# EAGLE design cominer_amp (EAGLE 7.6.0)

## Sheet 1 of 2
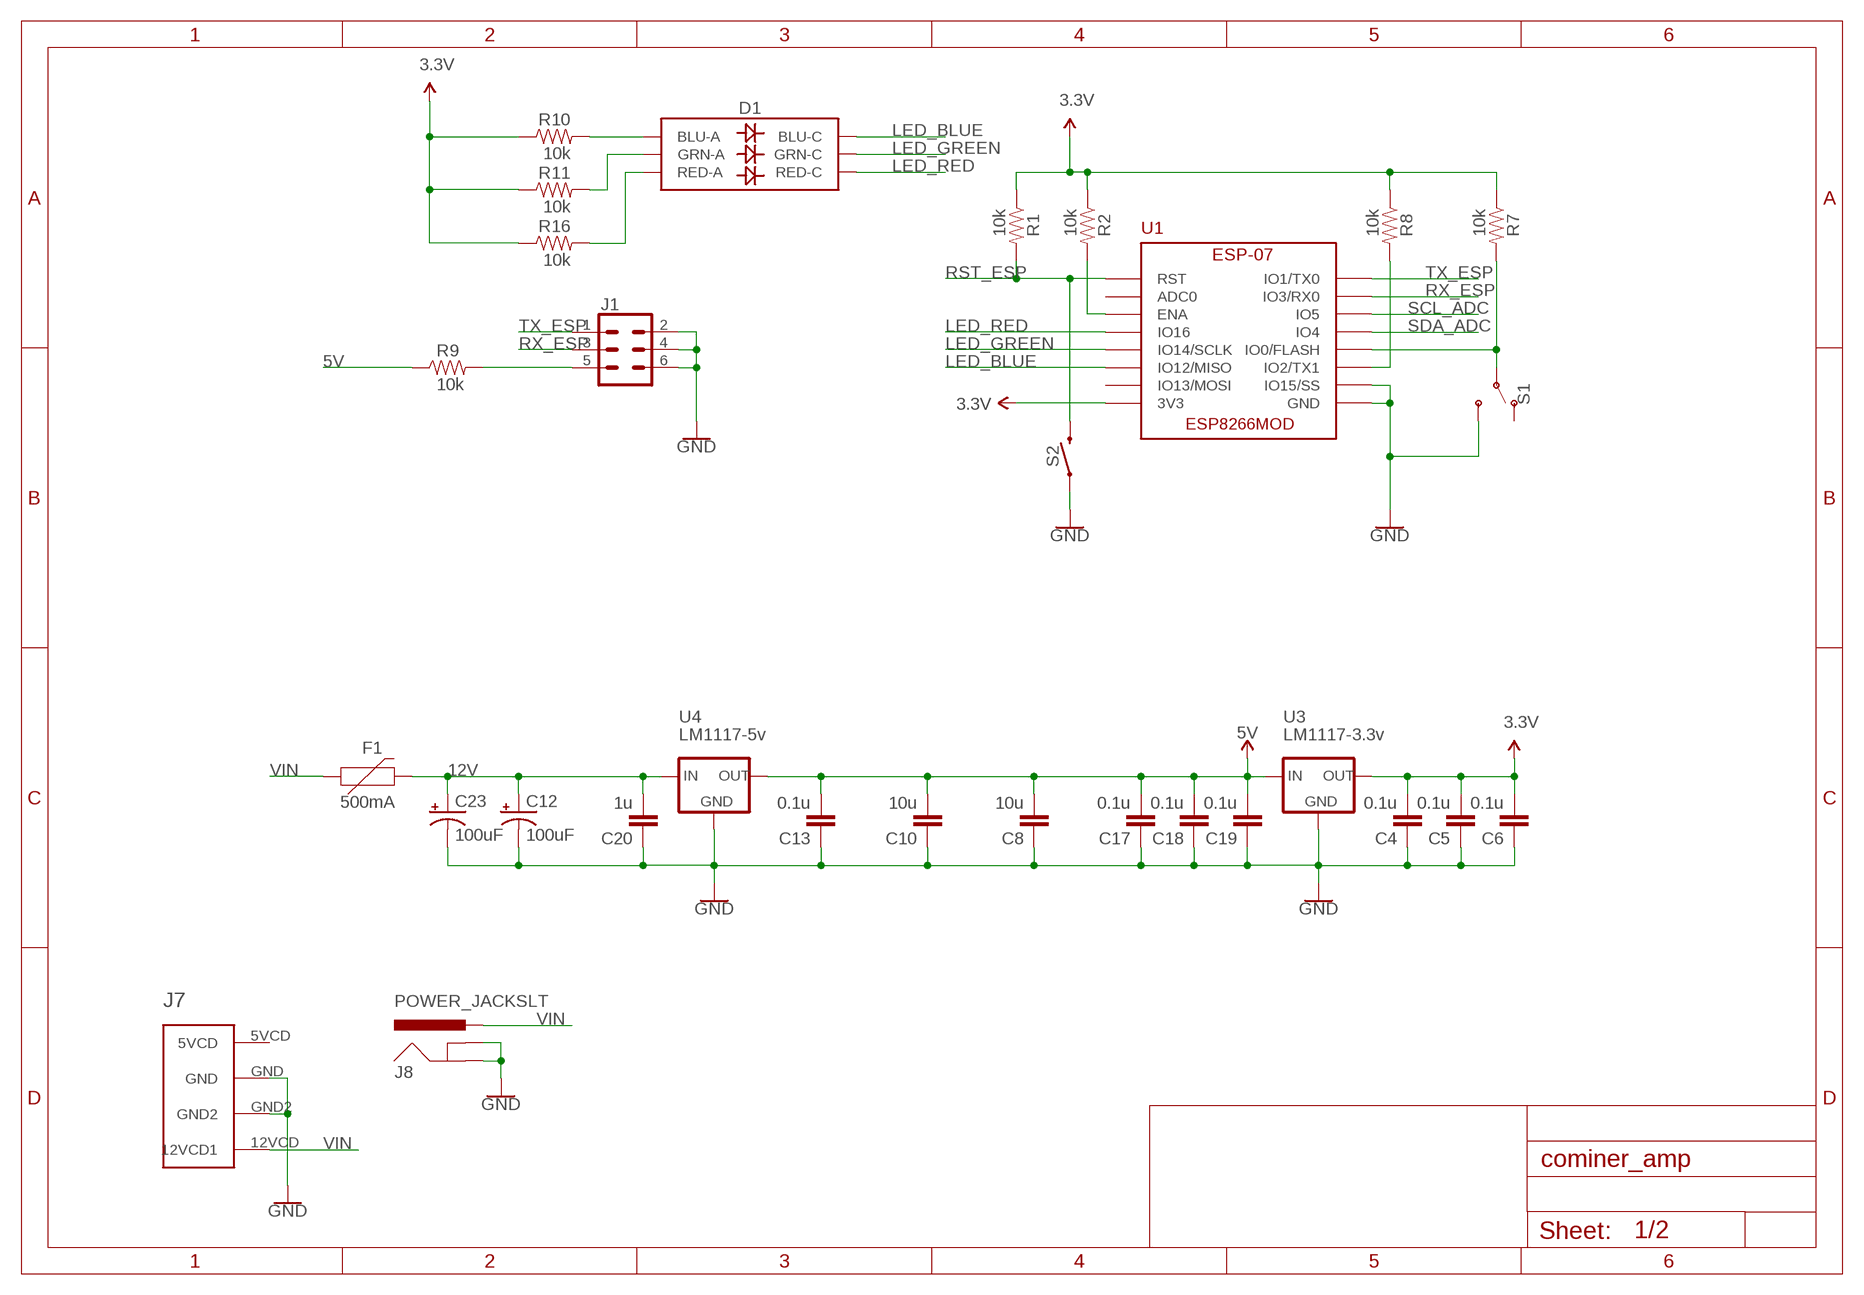
[diagram p0: schematic, sheet 1]

### Parts
C4  0.1u  CAP-0805  [0805]
C5  0.1u  CAP-0805  [0805]
C6  0.1u  CAP-0805  [0805]
C8  10u  CAP-0805  [0805]
C10  10u  CAP-0805  [0805]
C12  100uF  100UF-POLAR-25V-20%(ELEC)  [PANASONIC_D]
C13  0.1u  CAP-0805  [0805]
C17  0.1u  CAP-0805  [0805]
C18  0.1u  CAP-0805  [0805]
C19  0.1u  CAP-0805  [0805]
C20  1u  CAP-0805  [0805]
C23  100uF  100UF-POLAR-25V-20%(ELEC)  [PANASONIC_D]
D1  LED-RGBNO_IC  [LED-TRICOLOR-5050]
F1  500mA  PPTC_16V_2.5A  [1812]
J1  CONN_03X2SHROUD  [2X3-SHROUDED]
J7  MOLEX-CPU-POWER  [MOLEX-5.08-4PIN]
J8  POWER_JACKSLT  [POWER_JACK_SLOT]
R1  10k  RESISTOR0805  [0805]
R2  10k  RESISTOR0805  [0805]
R7  10k  RESISTOR0805  [0805]
R8  10k  RESISTOR0805  [0805]
R9  10k  RESISTOR0805  [0805]
R10  10k  RESISTOR0805  [0805]
R11  10k  RESISTOR0805  [0805]
R16  10k  RESISTOR0805  [0805]
S1  SWITCH-SPDT-SMD-RIGHT-ANGLE  [SWITCH_SPST_SMD_A]
S2  MOMENTARY-SWITCH-SPST-SMD-6.0X3.5MM  [TACTILE_SWITCH_SMD_6.0X3.5MM]
U1  ESP-07  [ESP-07]
U3  LM1117-3.3v  V_REG_LD1117VXXLD1117-SMD  [SOT223]
U4  LM1117-5v  V_REG_LD1117VXXLD1117-SMD  [SOT223]

### Nets
3.3V: C4.2 C5.2 C6.2 R1.1 R2.1 R7.1 R8.1 R10.1 R11.1 R16.1 U1.3V3 U3.2(OUT) ; also sheet 2
5V: C8.2 C10.2 C13.2 C17.2 C18.2 C19.2 R9.1 U3.3(IN) U4.2(OUT) ; also sheet 2
12V: C12.+ C20.2 C23.+ F1.2 U4.3(IN)
GND: C4.1 C5.1 C6.1 C8.1 C10.1 C12.- C13.1 C17.1 C18.1 C19.1 C20.1 C23.- J1.2 J1.4 J1.6 J7.GND J7.GND2 J8.GND@1(GNDBREAK) J8.GND@2(GND) S1.3(S) S2.1 U1.GND U1.IO15(IO15/SS) U3.1(GND) U4.1(GND) ; also sheet 2
LED_BLUE: D1.4(BLU-C) U1.IO12(IO12/MISO)
LED_GREEN: D1.6(GRN-C) U1.IO14(IO14/SCLK)
LED_RED: D1.5(RED-C) U1.I016(IO16)
N$2: R7.2 S1.2(P) U1.IO0(IO0/FLASH)
N$3: R8.2 U1.IO2(IO2/TX1)
N$4: J1.5 R9.2
N$8: D1.3(BLU-A) R10.2
N$9: D1.1(GRN-A) R11.2
N$10: D1.2(RED-A) R16.2
N$14: R2.2 U1.ENA
RST_ESP: R1.2 S2.2 U1.RST
RX_ESP: J1.3 U1.RX0(IO3/RX0)
SCL_ADC: U1.IO5 ; also sheet 2
SDA_ADC: U1.IO4 ; also sheet 2
TX_ESP: J1.1 U1.TX0(IO1/TX0)
VIN: F1.1 J7.12VCD(12VCD1) J8.PWR
Unconnected: J7.5VCD S1.1(O) U1.ADC(ADC0) U1.IO13(IO13/MOSI)

## Sheet 2 of 2
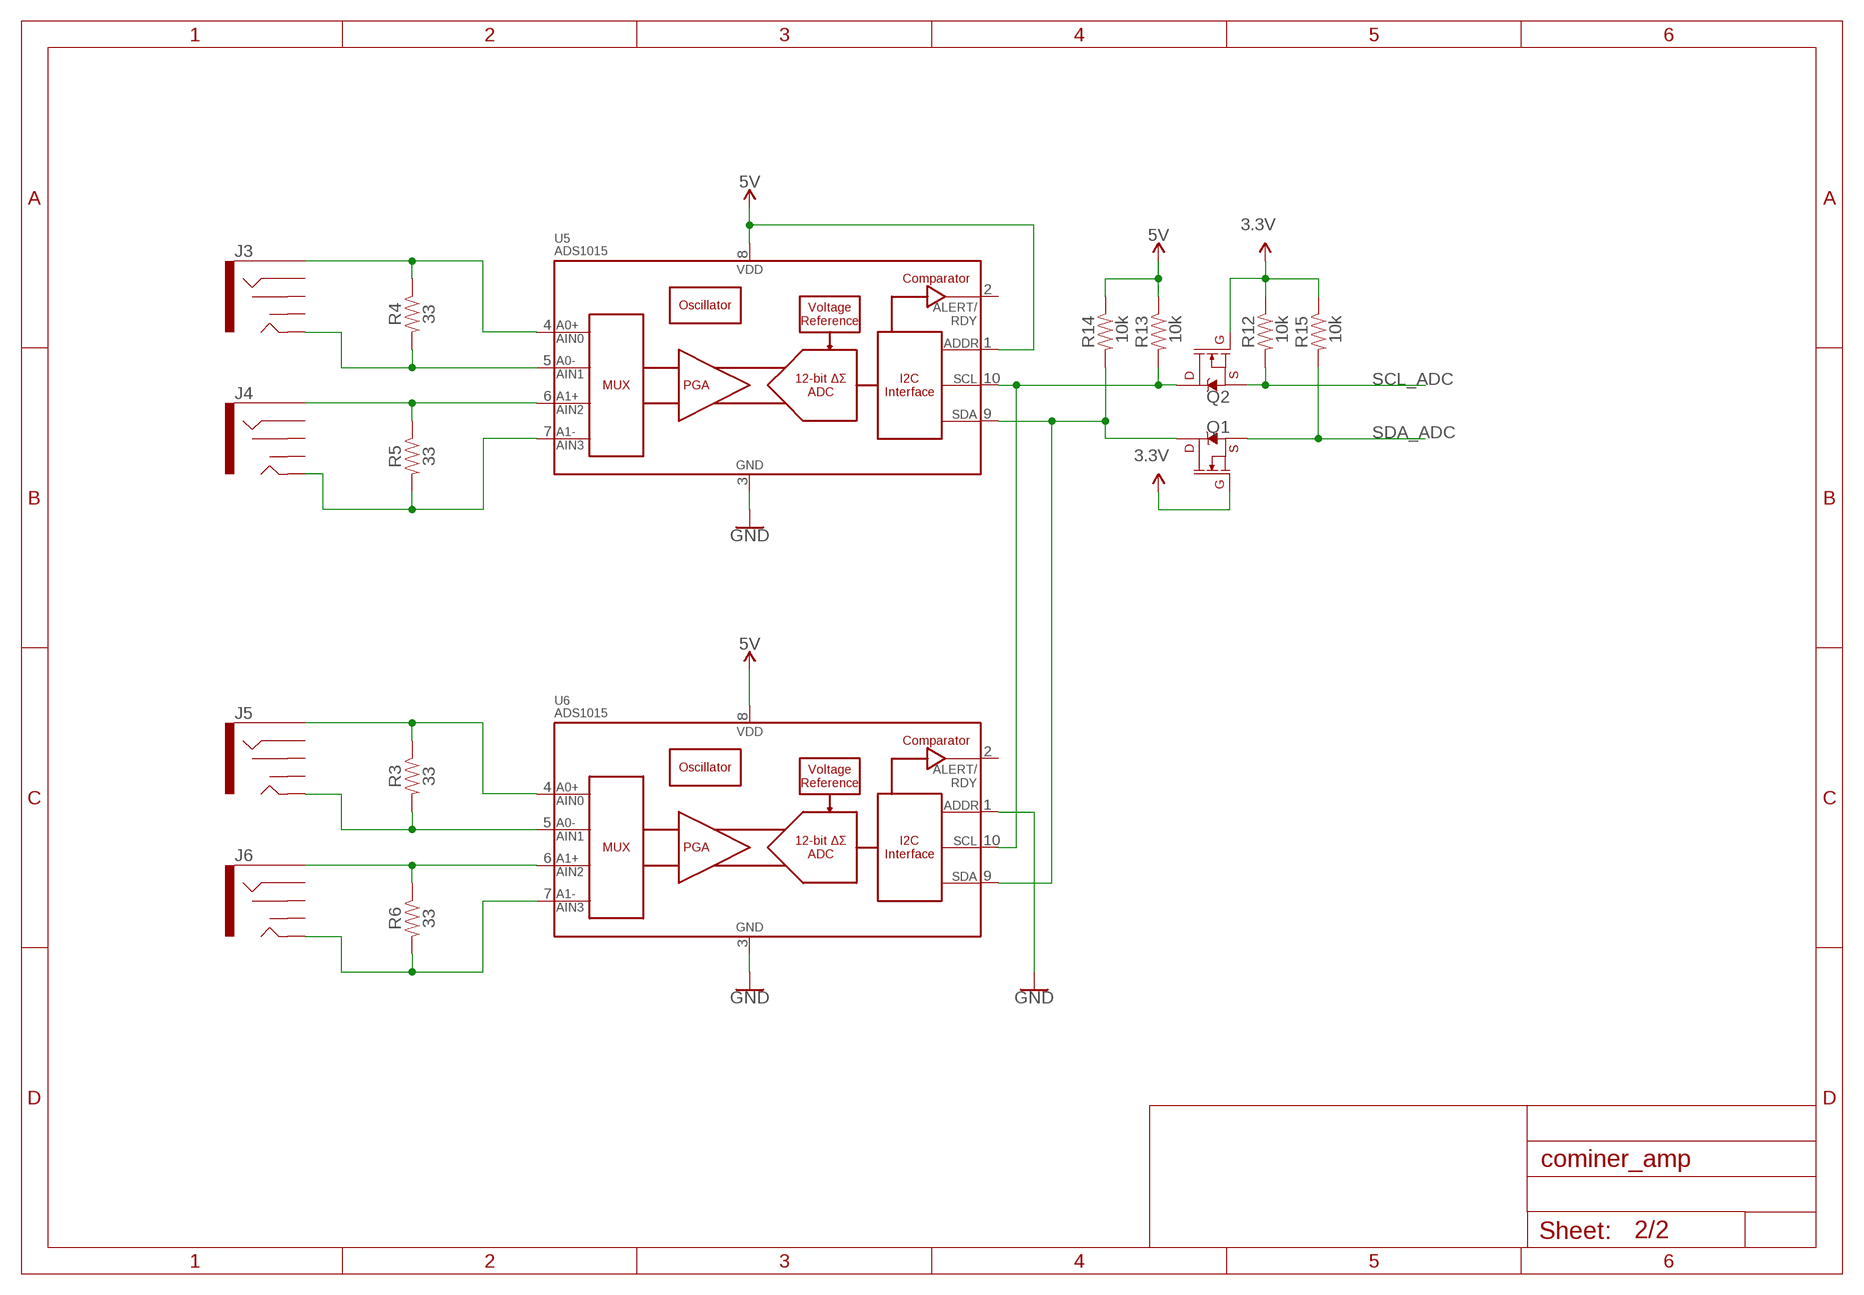
[diagram p1: schematic, sheet 2]

### Parts
J3  AUDIO_JACK_3.5MM_PTH  [AUDIO-JACK]
J4  AUDIO_JACK_3.5MM_PTH  [AUDIO-JACK]
J5  AUDIO_JACK_3.5MM_PTH  [AUDIO-JACK]
J6  AUDIO_JACK_3.5MM_PTH  [AUDIO-JACK]
Q1  BSS138  MOSFET-NCH-BSS138  [SOT23-3]
Q2  BSS138  MOSFET-NCH-BSS138  [SOT23-3]
R3  33  RESISTOR0805  [0805]
R4  33  RESISTOR0805  [0805]
R5  33  RESISTOR0805  [0805]
R6  33  RESISTOR0805  [0805]
R12  10k  RESISTOR0805  [0805]
R13  10k  RESISTOR0805  [0805]
R14  10k  RESISTOR0805  [0805]
R15  10k  RESISTOR0805  [0805]
U5  ADS1015  [MSOP10]
U6  ADS1015  [MSOP10]

### Nets
3.3V: Q1.1(G) Q2.1(G) R12.1 R15.1 ; also sheet 1
5V: R13.1 R14.1 U5.1(ADDR) U5.8(VDD) U6.8(VDD) ; also sheet 1
GND: U5.3(VSS) U6.1(ADDR) U6.3(VSS) ; also sheet 1
N$1: J4.TIP R5.2 U5.7(AIN3)
N$16: J3.SLEEVE R4.1 U5.4(AIN0)
N$17: J3.TIP R4.2 U5.5(AIN1)
N$19: J4.SLEEVE R5.1 U5.6(AIN2)
N$20: J5.TIP R3.2 U6.5(AIN1)
N$21: Q1.3(D) R14.2 U5.9(SDA) U6.9(SDA)
N$22: J5.SLEEVE R3.1 U6.4(AIN0)
N$23: Q2.3(D) R13.2 U5.10(SCL) U6.10(SCL)
N$24: J6.TIP R6.2 U6.7(AIN3)
N$25: J6.SLEEVE R6.1 U6.6(AIN2)
SCL_ADC: Q2.2(S) R12.2 ; also sheet 1
SDA_ADC: Q1.2(S) R15.2 ; also sheet 1
Unconnected: J3.RING J3.RSH J3.TSH J4.RING J4.RSH J4.TSH J5.RING J5.RSH J5.TSH J6.RING J6.RSH J6.TSH U5.2(ALERT/RDY) U6.2(ALERT/RDY)

## Library data of the parts
C4-C6 C8 C10 C13 C17-C20 = SparkFun-Capacitors:CAP
C12 C23 = SparkFun-Capacitors:100UF-POLAR: 100µF polarized capacitors A capacitor is a passive two-terminal electrical component used to store electrical energy temporarily in an electric field.; PROD_ID: CAP-12547
D1 = SparkFun-LED:LED-RGB: LED-RGB 6 pin RGB LED (no common connector) Packages: PLCC-6 LED-TRICOLOR-5050 - No built-in IC SparkFun Products: Digital Sandbox <https://www.sparkfun.com/products/12651> LED- SMD RGB <https://www.sparkfun.com/products/10866>; PROD_ID: DIO-10298
F1 = SparkFun-Fuses:PPTC: Resettable Fuse PPTC Resettable Fuse. Really a sort of resistor with a polymeric positive temperature coefficient whose resistance increases dramatically with an increase in temperature. When heated by the power passing through the resistance rises causing the current to be limited, protecting the circuit. This is achieved by the transition of the polymer from a crystalline to an amorphous state where the conductive carbon separates breaking the conductive pathways found in the cool crystalline structure. When a PPTC cools back down it resumes conducting letting the circuit turn back on. SparkFun Products: SparkFun RedBoard - Programmed with Arduino <https://www.sparkfun.com/products/12757> Pro Micro - 5V/16MHz <https://www.sparkfun.com/products/12640> Arduino Pro 328 - 5V/16MHz <https://www.sparkfun.com/products/10915> MP3 Trigger <https://www.sparkfun.com/products/13720>; PROD_ID: RES-14390; VALUE: 16V/2.5A(5A TRIP)
J1 = SparkFun-Connectors:CONN_03X2: Multi connection point. Often used as Generic Header-pin footprint for 0.1 inch spaced/style header connections You can populate with any combo of single row headers, but if you'd like an exact match, check these: Header - 2x3 (Male, 0.1") <https://www.sparkfun.com/products/12807> (PRT-12807) Header - 2x3 (Female, 0.1") <https://www.sparkfun.com/products/13010> (PRT-13010) 2x3 Pin Shrouded Header <https://www.sparkfun.com/products/10877> (PRT-10877) On any of the 0.1 inch spaced packages, you can populate with these: Break Away Headers - Straight <https://www.sparkfun.com/products/116> (PRT-00116) Break Away Male Headers - Right Angle <https://www.sparkfun.com/products/553> (PRT-00553) Female Headers <https://www.sparkfun.com/products/115> (PRT-00115) Break Away Headers - Machine Pin <https://www.sparkfun.com/products/117> (PRT-00117) Break Away Female Headers - Swiss Machine Pin <https://www.sparkfun.com/products/743> (PRT-00743) Special note: the shrouded connector mates well with our 3x2 ribbon cables: Ribbon Crimp Connector - 6-pin (2x3, Female) <https://www.sparkfun.com/products/10651> (PRT-10651) Ribbon Cable - 6 wire (15ft) <https://www.sparkfun.com/products/10646> (PRT-10646); PROD_ID: CONN-10681; SF_ID: PRT_10877
J3-J6 = SparkFun-Connectors:AUDIO_JACK_3.5MM: Audio Jack 3.5mm variants of PTH and SMT stereo audio jack with bypass switches. SparkFun Products: SparkFun SparkPunk Sound Kit <[https://www.sparkfun.com/products/11177]> - PTH MP3 Trigger <https://www.sparkfun.com/products/13720> -3.5mm SMD SparkFun PicoBoard <https://www.sparkfun.com/products/11888>- 2.5mm SMD; PROD_ID: CONN-08774; SF_ID: PRT-08032
J7 = MolexConn:MOLEX-CPU-POWER
J8 = SparkFun-Connectors:POWER_JACK: Power Jack Connector This is the standard 5.5mm barrel jack for power. The PTH is the most common, proven, reliable, footprint. The Slot footprint only works if the mill layer is transmitted to the PCB fab house so be warned. Here are the connectors we sell at SparkFun: DC Barrel Power Jack/Connector <https://www.sparkfun.com/products/119> (PRT-00119) DC Barrel Power Jack/Connector (SMD) <https://www.sparkfun.com/products/12748> (PRT-12748) DC Barrel Jack Adapter - Breadboard Compatible <https://www.sparkfun.com/products/10811> (PRT-10811) It is used on this SparkFun product (and many, many others): SparkFun RedBoard - Programmed with Arduino <https://www.sparkfun.com/products/12757> (DEV-12757) Also, if you need a mating power supply or connector, please check these out: Wall Adapter Power Supply - 9VDC 650mA <https://www.sparkfun.com/products/298> (TOL-00298) DC Barrel Jack Adapter - Male <https://www.sparkfun.com/products/10287> (PRT-10287); PROD_ID: PRT-00119
Q1 Q2 = SparkFun-DiscreteSemi:MOSFET-NCH: N-channel MOSFETs Voltage controlled devices that allow control of high current outputs. SparkFun Products: SparkFun OpenScale <https://www.sparkfun.com/products/13261> SparkFun Digital Sandbox <https://www.sparkfun.com/products/12651> SparkFun Monster Moto Shield <https://www.sparkfun.com/products/10182> SparkFun MOSFET Power Controller <https://www.sparkfun.com/products/11214>; PROD_ID: TRANS-00830; VALUE: 220mA/50V/3.5Ω
R1-R16 = SparkFun-Resistors:RESISTOR: Generic Resistor Package
S1 = SparkFun-Switches:SWITCH-SPDT: Single Pole, Double Throw (SPDT) Switch Single-pole, double-throw (SPDT) switch. Variant Overview SMD-AYZ0202 Surface Mount DPDT Switch <https://www.sparkfun.com/products/597> (COM-00597) Used on e.g. LilyPad Arduino USB - ATmega32U4 Board <https://www.sparkfun.com/products/12049> PTH-11.6X4.0MM SPDT Mini Power Switch <https://www.sparkfun.com/products/102> (COM-00102) Used on e.g. SparkFun Simon Says - Through-Hole Soldering Kit <https://www.sparkfun.com/products/10547> (KIT-10547) PTH-11.6X4.0MM-KIT KIT version of SPDT Mini Power Switch - Simplifies soldering by removing tStop of switch pins - only one side can be soldered. PTH-11.6X4.0MM-LOCK LOCK version of SPDT Mini Power Switch - Offset pins hold switch in place for easier soldering. SMD-RIGHT-ANGLE Surface Mount Right Angle Switch <https://www.sparkfun.com/products/10860> (COM-10860) Used on e.g. SparkFun ESP8266 Thing <https://www.sparkfun.com/products/13231>; PROD_ID: SWCH-10651; SF_SKU: COM-10860
S2 = SparkFun-Switches:MOMENTARY-SWITCH-SPST: Momentary Switch (Pushbutton) - SPST Normally-open (NO) SPST momentary switches (buttons, pushbuttons). Variants PTH-12MM - 12mm square, through-hole Momentary Pushbutton Switch - 12mm Square <https://www.sparkfun.com/products/9190> (COM-09190) PTH-6.0MM, PTH-6.0MM-KIT - 6.0mm square, through-hole Mini Pushbutton Switch <https://www.sparkfun.com/products/97> (COM-00097) KIT package intended for soldering kit's - only one side of pads' copper is exposed. PTH-RIGHT-ANGLE-KIT - Right-angle, through-hole Right Angle Tactile Button <https://www.sparkfun.com/products/10791> - Used on SparkFun BigTime Watch Kit <https://www.sparkfun.com/products/11734> SMD-12MM - 12mm square, surface-mount Tactile Button - SMD (12mm) <https://www.sparkfun.com/products/12993> (COM-12993) Used on SparkFun PicoBoard <https://www.sparkfun.com/products/11888> SMD-4.5MM - 4.5mm Square Trackball Switch Used on SparkFun Blackberry Trackballer Breakout <https://www.sparkfun.com/products/13169> SMD-4.6MMX2.8MM - 4.60mm x 2.80mm, surface mount Used on SparkFun SAMD21 Mini Breakout <https://www.sparkfun.com/products/13664> SMD-5.2MM, SMD-5.2-REDUNDANT - 5.2mm square, surface-mount Mini Pushbutton Switch - SMD <https://www.sparkfun.com/products/8720> (COM-08720) Used on Arduino Pro Mini <https://www.sparkfun.com/products/11114> REDUNDANT package connects both switch circuits together SMD-6.0X3.5MM - 6.0 x 3.5mm, surface mount Momentary Reset Switch SMD <https://www.sparkfun.com/products/8229> (COM-08229) SMD-6.2MM-TALL - 6.2mm square, surface mount Tactile Button - SMD (6mm) <https://www.sparkfun.com/products/12992> Used on SparkFun Digital Sandbox <https://www.sparkfun.com/products/12651> SMD-RIGHT-ANGLE - Right-angle, surface mount Used on SparkFun Block for Intel® Edison - Arduino <https://www.sparkfun.com/products/13036>; PROD_ID: SWCH-14278; SF_SKU: COM-08229
U1 = cominer library:ESP-07: Esp-07 Module Wifi ESP8266MOD by COMINER Team
U3 U4 = SparkFun-IC-Power:V_REG_LD1117VXX: LD1117VXX voltage regulator. We carry the 3.3V version (COM-00526) in TO-220 package.; PROD_ID: VREG-13917
U5 U6 = SparkFun-IC-Conversion:ADS1015: ADS1015 12-BIT ADC 12-Bit Del-Sig ADC Four single-ended inputs or two differential inputs Internal PGA I2C interface 2.0-5.5V SparkFun Products SparkFun Block for Intel Edison - ADC <https://www.sparkfun.com/products/13770> (DEV-13770); PROD_ID: IC-12270

## Board
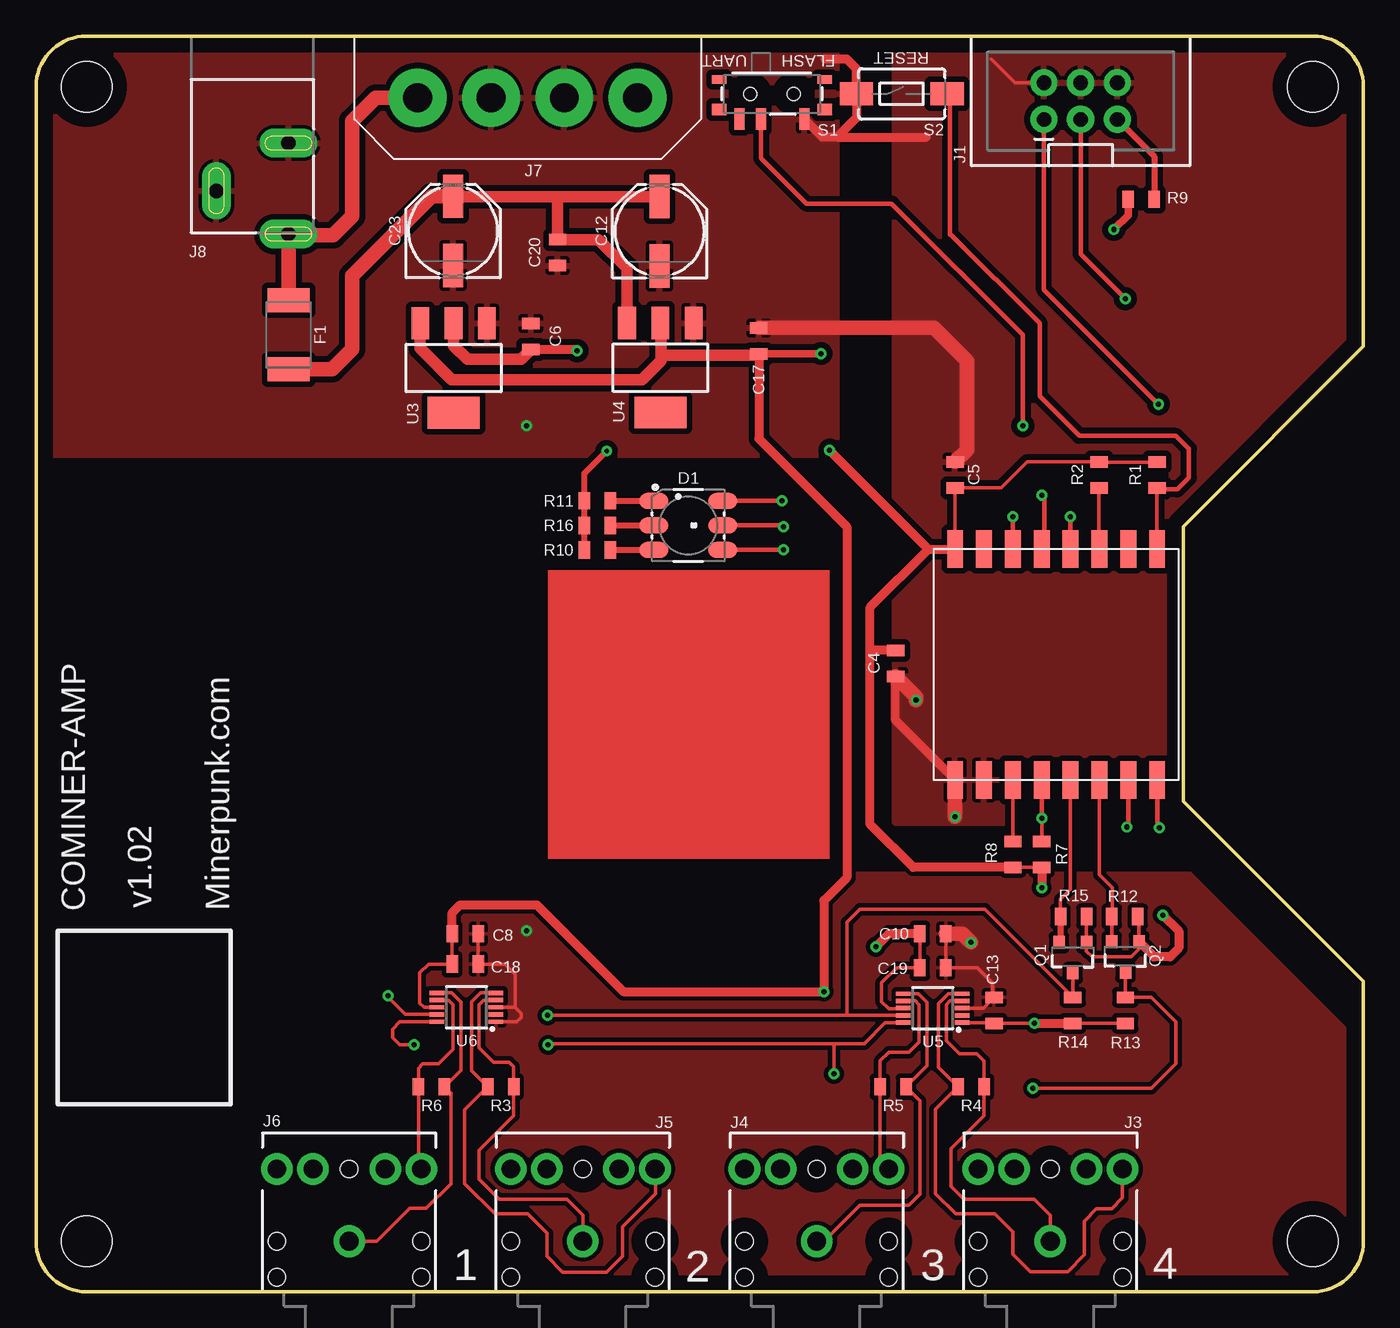
[diagram p2: board, top side]
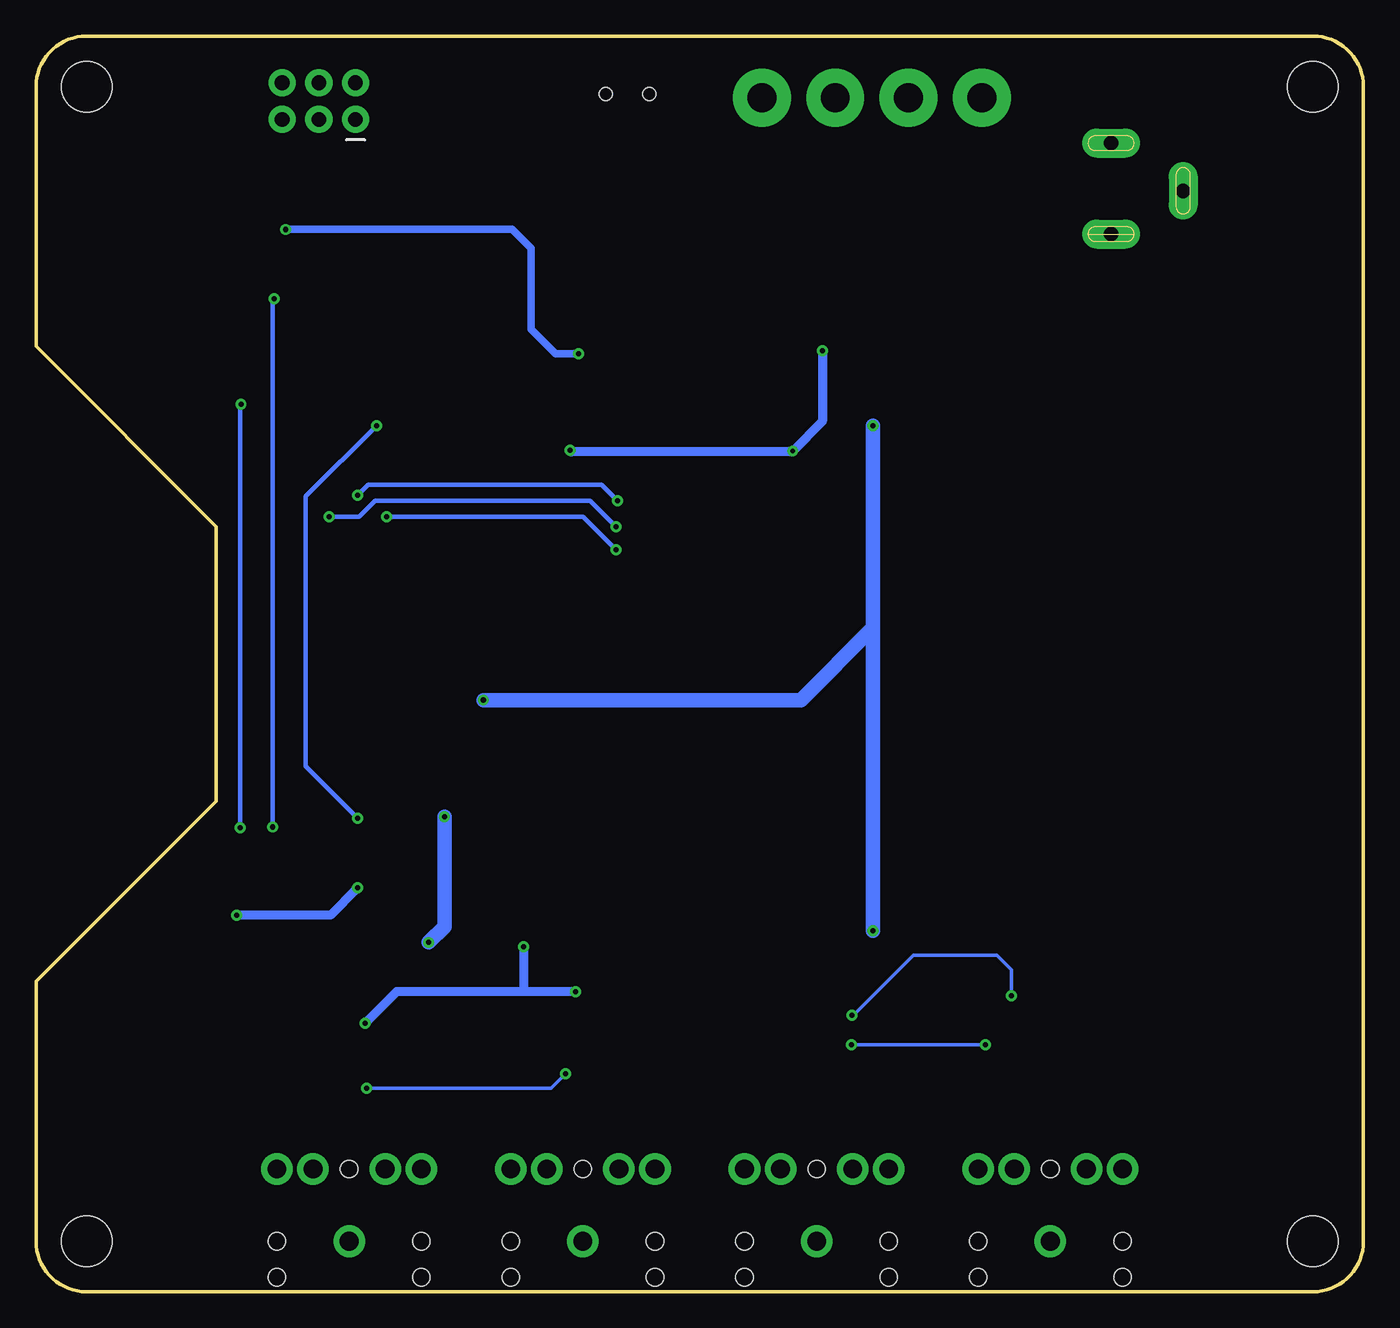
[diagram p3: board, bottom side, seen from below]

Size 92 x 87 mm. Coordinates in mm from the lower left corner, seen from the top.
Outline: 3.5,0 88.5,0 arc90 92,3.5 92,21.5 79.5,34 79.5,53 92,65.5 92,83.5 arc90 88.5,87 3.5,87 arc90 0,83.5 0,3.5 arc90 3.5,0
Copper layers (1*16): Top 0.035mm / dielectric 1.5mm / Bottom 0.035mm
Design rules "default": minimum track width 6mil, minimum drill 0.35mm, track to track 6mil, track to pad 6mil, pad to pad 6mil, via to via 6mil, smd to smd 6mil, copper to edge 40mil, drill to drill 6mil, minimum pad ring 10mil, minimum via ring 8mil, stop-mask expansion 4mil, vias tented up to drill 0mil, thermal gap 10mil
Holes 3.5 mm at 3.5,3.5 88.5,3.5 88.5,83.5 3.5,83.5

### Footprints (pad centres in the part's own frame; a part is rotated, then mirrored left to right if it is on the bottom)
0805 = smd 0.8 x 1.2: 1 -0.9,0; 2 0.9,0
PANASONIC_D = smd 3 x 1.4: + 2.4,0; - -2.4,0
LED-TRICOLOR-5050 = smd 2 x 1.1: 1 -2.4,1.7; 2 -2.4,0; 3 -2.4,-1.7; 4 2.4,-1.7; 5 2.4,0; 6 2.4,1.7
1812 = smd 1.676 x 2.896: 1 -2.388,0; 2 2.388,0
2X3-SHROUDED = drill 1.016 pad 1.88: 1 -1.27,2.54; 2 1.27,2.54; 3 -1.27,0; 4 1.27,0; 5 -1.27,-2.54; 6 1.27,-2.54
AUDIO-JACK = drill 1.3 pad 2.184: RING 5,5; RSH 5,2.5; SLEEVE 0,0; TIP 5,-5; TSH 5,-2.5 | hole 1.2: 0,5; -2.5,5; -2.5,-5; 0,-5; 5,0
MOLEX-5.08-4PIN = drill 2 pad 4: 5VCD 7.62,0; 12VCD -7.62,0; GND -2.54,0; GND2 2.54,0
POWER_JACK_SLOT = drill 1 pad 2 long: GND@1 2.58,7.5; GND@2 7.58,10.8; PWR 2.58,13.8
SOT23-3 = smd 0.8 x 0.9: 1 -0.95,-1; 2 0.95,-1; 3 0,1.1
SWITCH_SPST_SMD_A = smd 0.7 x 1.5: 1 -2.25,-1.75; 2 -0.75,-1.75; 3 2.25,-1.75 | smd 1 x 0.6: GND1 -3.65,1; GND3 3.65,1 | smd 1 x 0.8: GND2 -3.65,-1.1; GND4 3.65,-1.1 | hole 0.9: -1.5,0; 1.5,0
TACTILE_SWITCH_SMD_6.0X3.5MM = smd 2.3 x 1.6: 1 -3.15,0; 2 3.15,0
ESP-07 = smd 2.6 x 1.1: 3V3 0,1.5; ADC 0,13.5; ENA 0,11.5; GND 16,1.5; I016 0,9.5; IO0 16,7.5; IO2 16,5.5; IO4 16,9.5; IO5 16,11.5; IO12 0,5.5; IO13 0,3.5; IO14 0,7.5; IO15 16,3.5; RST 0,15.5; RX0 16,13.5; TX0 16,15.5
SOT223 = smd 1.219 x 2.235: 1 -2.311,-3.099; 2 0,-3.099; 3 2.311,-3.099 | smd 3.6 x 2.2: 4 0,3.099
MSOP10 = smd 0.3 x 1: 1 -1,-2.05; 2 -0.5,-2.05; 3 0,-2.05; 4 0.5,-2.05; 5 1,-2.05; 6 1,2.05; 7 0.5,2.05; 8 0,2.05; 9 -0.5,2.05; 10 -1,2.05

### Placement (x,y rotation side)
C4  59.57,43.54 90 top
C5  63.7,56.6 270 top
C6  34.3,66.2 270 top
C8  29.75,24.8 180 top
C10  62.15,24.8 180 top
C12  43.22,73.48 90 top
C13  66.4,19.5 270 top
C17  50.09,65.88 270 top
C18  29.75,22.7 180 top
C19  62.15,22.45 180 top
C20  36.15,72 90 top
C23  28.9,73.5 90 top
D1  45.2,53.1 0 top
F1  17.5,66.3 270 top
J1  72.4,82.5 90 top
J3  70.3,3.5 90 top
J4  54.1,3.5 90 top
J5  37.9,3.5 90 top
J6  21.7,3.5 90 top
J7  34.07,82.73 0 top
J8  20.07,87.08 180 top
Q1  71.85,23.2 180 top
Q2  75.5,23.25 180 top
R1  77.69,56.58 270 top
R2  73.67,56.59 270 top
R3  32.2,14.2 180 top
R4  64.8,14.2 180 top
R5  59.4,14.2 180 top
R6  27.4,14.2 180 top
R7  69.7,30.3 90 top
R8  67.7,30.3 90 top
R9  76.6,75.7 0 top
R10  38.9,51.4 0 top
R11  38.9,54.8 0 top
R12  75.45,26 180 top
R13  75.5,19.5 90 top
R14  71.85,19.5 90 top
R15  71.9,26 180 top
R16  38.9,53.1 0 top
S1  51,83 0 top
S2  60,83 0 top
U1  62.2,51.46 270 top
U3  28.94,64 180 top
U4  43.27,64.02 180 top
U5  62.15,19.65 90 top
U6  29.83,19.71 90 top

### Tracks (layer width: path | path; a pad name or v marks a point on that pad's centre or on a via)
3.3V  (via drill 0.3, 0.35)
  Top 0.254: R15.1 Q1.1 72.8,23.6 73.2,23.2 75.9,23.2 76.7,24 | R12.1 76.45,25.9 Q2.1 | U1.3V3 C5.2 66.9,55.7 68.7,57.5 R2.1 R1.1 | R8.1 R7.1
  Top 0.406: R10.1 R16.1 R11.1 38,56.7 v39.55,58.25
  Top 0.61: C6.2 37.4,65.3 v37.5,65.2 | v55,58.3 61.84,51.46 | 61.84,51.46 U1.3V3 | R8.1 60.8,29.4 57.8,32.4 57.8,44.6 | 57.8,44.6 57.8,47.42 61.84,51.46 | C4.2 57.96,44.44 57.8,44.6 | R7.1 v69.7,28 | v78.1,26.1 79.2,25 79.2,23.8 78.6,23.2 77.5,23.2 76.7,24 Q2.1
  Top 0.813: C6.2 33.6,64.6 29.9,64.6 28.94,65.56 U3.2
  Bottom 0.61: v37.5,65.2 37.5,60.3 v39.55,58.25 39.6,58.2 54.9,58.2 v55,58.3 | v69.7,28 71.6,26.1 v78.1,26.1
5V  (via drill 0.35)
  Top 0.254: C8.2 C18.2 27.2,22.7 26.6,22.1 26.6,20 26.89,19.71 U6.8 | C10.2 C19.2 59.65,22.45 58.6,21.4 58.6,20.1 59.1,19.6 60.05,19.6 U5.8 | R13.1 72.1,18.6 R14.1 v69.2,18.6 C13.2 66.35,18.65 U5.1
  Top 0.508: R9.1 75.7,74.6 v74.7,73.6 | v54.4,65 50.11,65 C17.2
  Top 0.61: C8.2 28.85,26.25 29.4,26.8 34.7,26.8 40.7,20.8 v54.6,20.8 54.6,27.1 56.2,28.7 56.2,53 50.09,59.11 C17.2 | v69.2,18.6 72.1,18.6 | C10.2 59.1,24.8 v58.2,23.9
  Top 0.813: U3.3 26.63,65.37 28.8,63.2 42,63.2 43.3,64.5 43.3,64.9 | 43.3,64.9 43.3,67.09 U4.2 | C17.2 50.01,64.9 43.3,64.9
  Bottom 0.508: v74.7,73.6 59,73.6 57.7,72.3 57.7,66.7 56,65 v54.4,65
  Bottom 0.61: v54.6,20.8 58.2,20.8 | 58.2,20.8 67,20.8 v69.2,18.6 | v58.2,23.9 58.2,20.8
12V
  Top 0.813: C12.+ 36.2,75.88 | 36.2,75.88 29.4,75.88 28.92,75.88 C23.+ | 36.2,75.88 36.15,75.83 C20.2 39,72.9 40.96,70.94 U4.3
  Top 1.016: F1.2 20.51,63.91 21.9,65.3 21.9,70.4 27.4,75.9 29.38,75.9 29.4,75.88
GND  (via drill 0.35)
  Top 0.254: C8.1 C18.1 32.5,22.7 33.2,22 33.2,19.72 33.19,19.71 | C10.1 C19.1 65.25,22.45 66.3,21.4 66.3,20.5 C13.1 65.65,19.65 U5.3 | J1.2 67.83,83.77 66.2,85.4 | U6.3 33.19,19.71 | 33.19,19.71 33.6,19.3 33.6,19 33.3,18.7 U6.1
  Top 0.406: C6.1
  Top 0.61: U1.GND 59.57,39.59 C4.1 | 55.5,80 56.85,81.35 S2.1 56.85,84.75 56.2,85.4 54.7,85.4 | 55.5,80 54.5,80 S1.3 | 55.5,80 61.7,80
  Top 1.016: C17.1 62.22,66.78 64.5,64.5 64.5,58.3 C5.1 | U1.GND v63.7,32.9 | v64.8,24.2 64.2,24.8 C10.1 | C4.1 61,41.21 v61,41
  Bottom 1.016: v63.7,32.9 63.7,25.3 v64.8,24.2 | v61,41 39,41 34,46 | 34,46 v34,60 | 34,46 v34,25
  pour Top (isolate 0.406): -1.5,58 55.5,58 55.5,88.5 -1.5,88.5
  pour Top (isolate 0.406): 59.5,88.5 59.5,32.5 94.5,32.5 94.5,88.5
  pour Top (isolate 0.305): 80,29 21,29 13,21 13,-1 93,-1 93,16
LED_BLUE  (via drill 0.35)
  Top 0.305: D1.4 v51.8,51.4 | v67.7,53.7 U1.IO12
  Bottom 0.305: v51.8,51.4 54.1,53.7 v67.7,53.7
LED_GREEN  (via drill 0.35)
  Top 0.305: D1.6 v51.7,54.8 | v69.7,55.2 69.9,55 69.9,51.66 U1.IO14
  Bottom 0.305: v51.7,54.8 52.8,55.9 69,55.9 v69.7,55.2
LED_RED  (via drill 0.35)
  Top 0.305: D1.5 51.8,53.1 v51.8,53 | v71.7,53.7 U1.I016
  Bottom 0.305: v51.8,53 53.6,54.8 68.5,54.8 69.6,53.7 v71.7,53.7
N$1
  Top 0.254: U5.7 60.95,20.15 61.2,19.9 61.2,17.3 60.5,16.6 59.1,16.6 58.5,16 R5.2 58.5,9.1 J4.TIP
N$2  (via drill 0.35)
  Top 0.254: U1.IO0 69.7,35.1 | v69.7,32.8 R7.2
  Top 0.305: S1.2 50.25,78.55 53.4,75.4 59.3,75.4 68.4,66.3 v68.4,60 | v69.7,32.8 69.7,35.1
  Bottom 0.305: v68.4,60 73.3,55.1 73.3,36.4 v69.7,32.8
N$3
  Top 0.254: U1.IO2 R8.2
N$4
  Top 0.406: J1.5 77.5,78.67 R9.2
N$8
  Top 0.406: R10.2 D1.3
N$9
  Top 0.406: R11.2 D1.1
N$10
  Top 0.406: R16.2 D1.2
N$14
  Top 0.254: R2.2 73.67,52.13 73.7,52.1 U1.ENA
N$16
  Top 0.254: U5.4 63.35,20.15 63.1,19.9 63.1,17.4 64,16.5 65.2,16.5 65.7,16 R4.1 65.7,12.2 63.4,9.9 63.4,7.3 64.3,6.4 69.2,6.4 70.3,5.3 J3.SLEEVE
N$17
  Top 0.254: J3.TIP 75.3,6.5 74.55,5.75 73.5,5.75 72.65,4.9 72.65,2.55 71.5,1.4 68.9,1.4 67.7,2.6 67.7,4.15 66.45,5.4 63.75,5.4 62.35,6.8 62.35,12.65 R4.2 62.55,15.55 62.55,19.95 63.25,20.65 U5.5
N$19
  Top 0.254: U5.6 61.15,20.65 61.75,20.05 61.75,15.65 R5.1 61.25,13.25 61.25,6.75 60.5,6 57.1,6 54.6,3.5 J4.SLEEVE
N$20
  Top 0.254: U6.5 30.81,20.71 30.2,20.1 30.2,15.3 R3.2 29.7,12.6 29.7,7.5 31.8,5.4 34.05,5.4 35.4,4.05 35.4,2.45 36.5,1.35 39.55,1.35 40.65,2.45 40.65,4.5 42.95,6.8 42.95,8.45 J5.TIP
N$21  (via drill 0.35)
  Top 0.254: Q1.3 R14.2 65.75,26.5 57.1,26.5 56.2,25.6 56.2,19.15 | U6.9 25.59,19.21 24.4,20.4 v24.4,20.5 | v35.45,19.15 56.2,19.15 | 56.2,19.15 U5.9
  Bottom 0.254: v24.4,20.5 24.4,22.3 25.4,23.3 31.2,23.3 35.4,19.1 v35.45,19.15
N$22
  Top 0.254: J5.SLEEVE 37.9,5.3 36.8,6.4 32.1,6.4 30.7,7.8 30.7,9.8 33.1,12.2 R3.1 33.1,15.6 32.8,15.9 31.7,15.9 30.7,16.9 30.7,19.9 31.01,20.21 U6.4
N$23  (via drill 0.35)
  Top 0.254: Q2.3 R13.2 77.3,20.4 79,18.7 79,15.8 77.3,14.1 v69.1,14.1 | U5.10 58.85,18.65 57.4,17.2 55.3,17.2 | 55.3,17.2 35.5,17.2 v35.5,17.1 | v26.2,17.1 25.2,17.1 24.7,17.6 24.7,18.2 25.21,18.71 U6.10 | v55.3,15.1 55.3,17.2
  Bottom 0.254: v35.5,17.1 v26.2,17.1 | v69.1,14.1 56.3,14.1 v55.3,15.1
N$24
  Top 0.254: U6.7 28.59,20.21 28.9,19.9 28.9,16.8 27.9,15.8 26.8,15.8 26.5,15.5 R6.2 26.5,8.7 J6.TIP
N$25
  Top 0.254: J6.SLEEVE 23.6,3.5 25.9,5.8 27.05,5.8 28.75,7.5 28.75,13.75 R6.1 29.45,15.35 29.45,20.05 28.79,20.71 U6.6
RST_ESP
  Top 0.254: R1.2 77.69,55.6 U1.RST
  Top 0.305: S2.2 63.35,82.8 63.35,73.25 63.4,73.25 69.56,67.09 69.56,62.04 72.3,59.3 79,59.3 79.9,58.4 79.9,56.4 79.1,55.6 77.69,55.6
RX_ESP  (via drill 0.35)
  Top 0.305: U1.RX0 75.7,32.3 v75.6,32.2 | v75.5,68.8 72.4,71.9 J1.3
  Bottom 0.305: v75.6,32.2 75.6,68.8 v75.5,68.8
SCL_ADC
  Top 0.254: Q2.2 R12.2 74.6,26.05 74.6,28 73.7,28.9 U1.IO5
SDA_ADC
  Top 0.254: U1.IO4 71.7,27.9 71,27.2 R15.2
  Top 0.406: R15.2 71,24.3 Q1.2
TX_ESP  (via drill 0.35)
  Top 0.305: U1.TX0 77.7,32.4 77.9,32.2 v77.85,32.15 | v77.8,61.5 69.86,69.44 J1.1
  Bottom 0.305: v77.85,32.15 77.85,61.45 v77.8,61.5
VIN
  Top 1.016: J7.12VCD 23.53,82.73 21.9,81.1 21.9,74.5 20.6,73.2 17.57,73.2 J8.PWR F1.1
(copper drawn outside any net)
  shapes: Top area x1

### Text on the board
tPlace: UART | FLASH | RESET | v1.02 | COMINER-AMP | Minerpunk.com | 1 | 2 | 3 | 4
200bmp: MINER PUNK